# Altium schematic sheet v1.0.SchDoc
size 254 x 114 mm
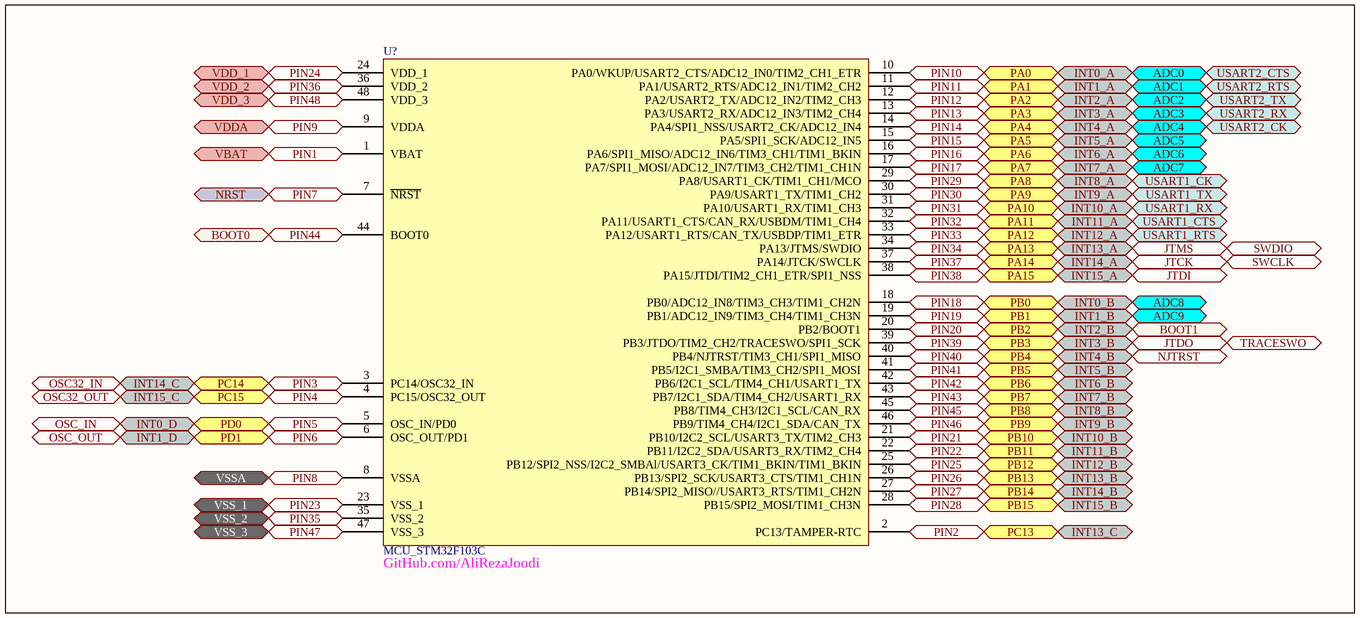
[diagram p0: v1.0.SchDoc]

## Parts
U?  MCU_STM32F103C  [LQFP48_7x7MM]

## Ports
ADC0 (bidir), ADC1 (bidir), ADC2 (bidir), ADC3 (bidir), ADC4 (bidir), ADC5 (bidir), ADC6 (bidir), ADC7 (bidir), ADC8 (bidir), ADC9 (bidir), BOOT0, BOOT1 (bidir), INT0_A (bidir), INT0_B (bidir), INT0_D (in), INT1_A (bidir), INT1_B (bidir), INT1_D (in), INT2_A (bidir), INT2_B (bidir), INT3_A (bidir), INT3_B (bidir), INT4_A (bidir), INT4_B (bidir), INT5_A (bidir), INT5_B (bidir), INT6_A (bidir), INT6_B (bidir), INT7_A (bidir), INT7_B (bidir), INT8_A (bidir), INT8_B (bidir), INT9_A (bidir), INT9_B (bidir), INT10_A (bidir), INT10_B (bidir), INT11_A (bidir), INT11_B (bidir), INT12_A (bidir), INT12_B (bidir), INT13_A (bidir), INT13_B (bidir), INT13_C (bidir), INT14_A (bidir), INT14_B (bidir), INT14_C (in), INT15_A (bidir), INT15_B (bidir), INT15_C (in), JTCK (bidir), JTDI (bidir), JTDO (bidir), JTMS (bidir), NJTRST (bidir), NRST, OSC32_IN (in), OSC32_OUT (in), OSC_IN (in), OSC_OUT (in), PA0 (bidir), PA1 (bidir), PA2 (bidir), PA3 (bidir), PA4 (bidir), PA5 (bidir), PA6 (bidir), PA7 (bidir), PA8 (bidir), PA9 (bidir), PA10 (bidir), PA11 (bidir), PA12 (bidir), PA13 (bidir), PA14 (bidir), PA15 (bidir), PB0 (bidir), PB1 (bidir), PB2 (bidir), PB3 (bidir), PB4 (bidir), PB5 (bidir), PB6 (bidir), PB7 (bidir), PB8 (bidir), PB9 (bidir), PB10 (bidir), PB11 (bidir), PB12 (bidir), PB13 (bidir), PB14 (bidir), PB15 (bidir), PC13 (bidir), PC14 (bidir), PC15 (bidir), PD0 (bidir), PD1 (bidir), PIN1, PIN2, PIN3, PIN4, PIN5, PIN6, PIN7, PIN8, PIN9, PIN10, PIN11, PIN12, PIN13, PIN14, PIN15, PIN16, PIN17, PIN18, PIN19, PIN20, PIN21, PIN22, PIN23, PIN24, PIN25, PIN26, PIN27, PIN28, PIN29, PIN30, PIN31, PIN32, PIN33, PIN34, PIN35, PIN36, PIN37, PIN38, PIN39, PIN40, PIN41, PIN42, PIN43, PIN44, PIN45, PIN46, PIN47, PIN48, SWCLK (bidir), SWDIO (bidir), TRACESWO (bidir), USART1_CK (bidir), USART1_CTS (bidir), USART1_RTS (bidir), USART1_RX (bidir), USART1_TX (bidir), USART2_CK (bidir), USART2_CTS (bidir), USART2_RTS (bidir), USART2_RX (bidir), USART2_TX (bidir), VBAT, VDD_1, VDD_2, VDD_3, VDDA, VSS_1, VSS_2, VSS_3, VSSA

## Nets
ADC0: U?.10(PA0/WKUP/USART2_CTS/ADC12_IN0/TIM2_CH1_ETR) ; port PA0, port INT0_A, port USART2_CTS, port ADC0, port PIN10
ADC1: U?.11(PA1/USART2_RTS/ADC12_IN1/TIM2_CH2) ; port PA1, port USART2_RTS, port INT1_A, port ADC1, port PIN11
ADC2: U?.12(PA2/USART2_TX/ADC12_IN2/TIM2_CH3) ; port PA2, port USART2_TX, port INT2_A, port ADC2, port PIN12
ADC3: U?.13(PA3/USART2_RX/ADC12_IN3/TIM2_CH4) ; port PA3, port USART2_RX, port INT3_A, port ADC3, port PIN13
ADC4: U?.14(PA4/SPI1_NSS/USART2_CK/ADC12_IN4) ; port PA4, port INT4_A, port USART2_CK, port ADC4, port PIN14
ADC5: U?.15(PA5/SPI1_SCK/ADC12_IN5) ; port PA5, port INT5_A, port ADC5, port PIN15
ADC6: U?.16(PA6/SPI1_MISO/ADC12_IN6/TIM3_CH1/TIM1_BKIN) ; port PA6, port INT6_A, port ADC6, port PIN16
ADC7: U?.17(PA7/SPI1_MOSI/ADC12_IN7/TIM3_CH2/TIM1_CH1N) ; port PA7, port INT7_A, port ADC7, port PIN17
ADC8: U?.18(PB0/ADC12_IN8/TIM3_CH3/TIM1_CH2N) ; port PB0, port INT0_B, port ADC8, port PIN18
ADC9: U?.19(PB1/ADC12_IN9/TIM3_CH4/TIM1_CH3N) ; port PB1, port INT1_B, port ADC9, port PIN19
BOOT0: U?.44(BOOT0) ; port BOOT0, port PIN44
BOOT1: U?.20(PB2/BOOT1) ; port PB2, port INT2_B, port BOOT1, port PIN20
INT0_D: U?.5(OSC_IN/PD0) ; port PD0, port INT0_D, port OSC_IN, port PIN5
INT1_D: U?.6(OSC_OUT/PD1) ; port PD1, port INT1_D, port OSC_OUT, port PIN6
INT3_B: U?.39(PB3/JTDO/TIM2_CH2/TRACESWO/SPI1_SCK) ; port PB3, port INT3_B, port JTDO, port TRACESWO, port PIN39
INT4_B: U?.40(PB4/NJTRST/TIM3_CH1/SPI1_MISO) ; port PB4, port INT4_B, port NJTRST, port PIN40
INT5_B: U?.41(PB5/I2C1_SMBA/TIM3_CH2/SPI1_MOSI) ; port PB5, port INT5_B, port PIN41
INT6_B: U?.42(PB6/I2C1_SCL/TIM4_CH1/USART1_TX) ; port PB6, port INT6_B, port PIN42
INT7_B: U?.43(PB7/I2C1_SDA/TIM4_CH2/USART1_RX) ; port PB7, port INT7_B, port PIN43
INT8_A: U?.29(PA8/USART1_CK/TIM1_CH1/MCO) ; port PA8, port USART1_CK, port INT8_A, port PIN29
INT8_B: U?.45(PB8/TIM4_CH3/I2C1_SCL/CAN_RX) ; port PB8, port INT8_B, port PIN45
INT9_A: U?.30(PA9/USART1_TX/TIM1_CH2) ; port PA9, port USART1_TX, port INT9_A, port PIN30
INT9_B: U?.46(PB9/TIM4_CH4/I2C1_SDA/CAN_TX) ; port PB9, port INT9_B, port PIN46
INT10_A: U?.31(PA10/USART1_RX/TIM1_CH3) ; port PA10, port USART1_RX, port INT10_A, port PIN31
INT10_B: U?.21(PB10/I2C2_SCL/USART3_TX/TIM2_CH3) ; port PB10, port INT10_B, port PIN21
INT11_A: U?.32(PA11/USART1_CTS/CAN_RX/USBDM/TIM1_CH4) ; port PA11, port USART1_CTS, port INT11_A, port PIN32
INT11_B: U?.22(PB11/I2C2_SDA/USART3_RX/TIM2_CH4) ; port PB11, port INT11_B, port PIN22
INT12_A: U?.33(PA12/USART1_RTS/CAN_TX/USBDP/TIM1_ETR) ; port PA12, port USART1_RTS, port INT12_A, port PIN33
INT12_B: U?.25(PB12/SPI2_NSS/I2C2_SMBAl/USART3_CK/TIM1_BKIN/TIM1_BKIN) ; port PB12, port INT12_B, port PIN25
INT13_A: U?.34(PA13/JTMS/SWDIO) ; port PA13, port INT13_A, port JTMS, port SWDIO, port PIN34
INT13_B: U?.26(PB13/SPI2_SCK/USART3_CTS/TIM1_CH1N) ; port PB13, port INT13_B, port PIN26
INT13_C: U?.2(PC13/TAMPER-RTC) ; port PC13, port INT13_C, port PIN2
INT14_A: U?.37(PA14/JTCK/SWCLK) ; port PA14, port INT14_A, port JTCK, port SWCLK, port PIN37
INT14_B: U?.27(PB14/SPI2_MISO//USART3_RTS/TIM1_CH2N) ; port PB14, port INT14_B, port PIN27
INT14_C: U?.3(PC14/OSC32_IN) ; port PC14, port INT14_C, port OSC32_IN, port PIN3
INT15_A: U?.38(PA15/JTDI/TIM2_CH1_ETR/SPI1_NSS) ; port PA15, port INT15_A, port JTDI, port PIN38
INT15_B: U?.28(PB15/SPI2_MOSI/TIM1_CH3N) ; port PB15, port INT15_B, port PIN28
INT15_C: U?.4(PC15/OSC32_OUT) ; port PC15, port INT15_C, port OSC32_OUT, port PIN4
NRST: U?.7(~{NRST}) ; port NRST, port PIN7
PIN1: U?.1(VBAT) ; port VBAT, port PIN1
PIN8: U?.8(VSSA) ; port VSSA, port PIN8
PIN9: U?.9(VDDA) ; port VDDA, port PIN9
PIN23: U?.23(VSS_1) ; port VSS_1, port PIN23
PIN24: U?.24(VDD_1) ; port VDD_1, port PIN24
PIN35: U?.35(VSS_2) ; port VSS_2, port PIN35
PIN36: U?.36(VDD_2) ; port VDD_2, port PIN36
PIN47: U?.47(VSS_3) ; port VSS_3, port PIN47
PIN48: U?.48(VDD_3) ; port VDD_3, port PIN48

## Notes on the sheet
- (near U?) GitHub.com/AliRezaJoodi